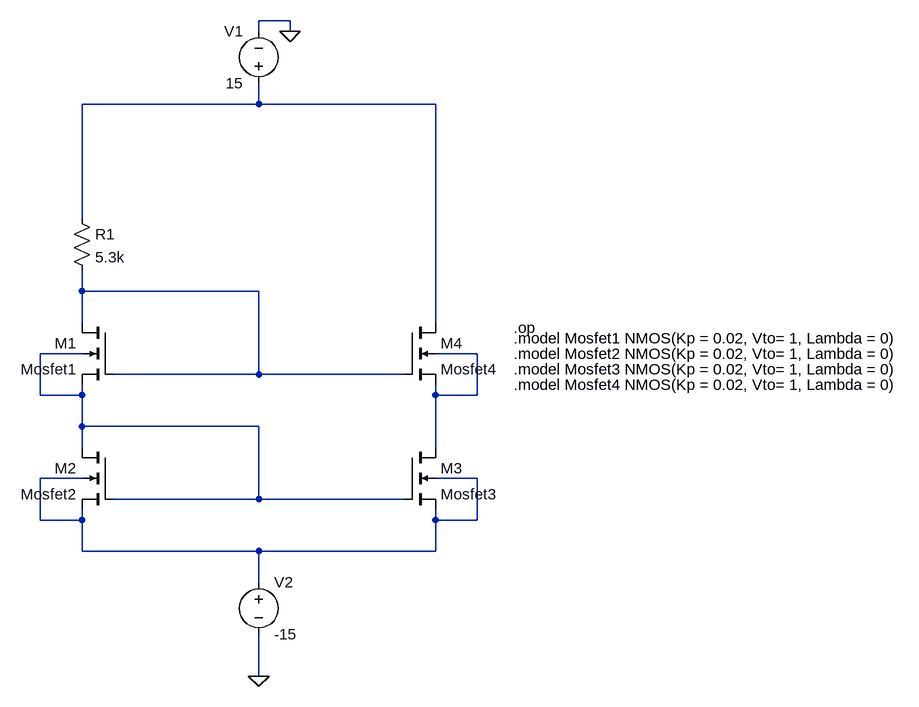
[diagram p0: schematic Simulation Bonus.asc]
Simulation Bonus.asc, the LTspice schematic file:
Version 4.1
SHEET 1 1464 868
WIRE 480 -192 432 -192
WIRE 432 -176 432 -192
WIRE 480 -176 480 -192
WIRE 432 -64 432 -96
WIRE 432 -64 160 -64
WIRE 704 -64 432 -64
WIRE 160 112 160 -64
WIRE 160 224 160 192
WIRE 432 224 160 224
WIRE 160 272 160 224
WIRE 704 272 704 -64
WIRE 160 320 96 320
WIRE 768 320 704 320
WIRE 432 352 432 224
WIRE 432 352 208 352
WIRE 656 352 432 352
WIRE 96 384 96 320
WIRE 160 384 160 368
WIRE 160 384 96 384
WIRE 704 384 704 368
WIRE 768 384 768 320
WIRE 768 384 704 384
WIRE 160 432 160 384
WIRE 432 432 160 432
WIRE 160 464 160 432
WIRE 704 464 704 384
WIRE 160 512 96 512
WIRE 768 512 704 512
WIRE 432 544 432 432
WIRE 432 544 208 544
WIRE 656 544 432 544
WIRE 96 576 96 512
WIRE 160 576 160 560
WIRE 160 576 96 576
WIRE 704 576 704 560
WIRE 768 576 768 512
WIRE 768 576 704 576
WIRE 160 624 160 576
WIRE 432 624 160 624
WIRE 704 624 704 576
WIRE 704 624 432 624
WIRE 432 672 432 624
WIRE 432 816 432 752
FLAG 432 816 0
FLAG 480 -176 0
SYMBOL res 144 96 R0
SYMATTR InstName R1
SYMATTR Value 5.3k
SYMBOL nmos4 208 272 M0
SYMATTR InstName M1
SYMATTR Value Mosfet1
SYMBOL nmos4 208 464 M0
SYMATTR InstName M2
SYMATTR Value Mosfet2
SYMBOL nmos4 656 464 R0
SYMATTR InstName M3
SYMATTR Value Mosfet3
SYMBOL nmos4 656 272 R0
SYMATTR InstName M4
SYMATTR Value Mosfet4
SYMBOL voltage 432 656 R0
WINDOW 123 0 0 Left 0
WINDOW 39 0 0 Left 0
SYMATTR InstName V2
SYMATTR Value -15
SYMBOL voltage 432 -80 R180
WINDOW 0 24 96 Left 2
WINDOW 3 24 16 Left 2
WINDOW 123 0 0 Left 0
WINDOW 39 0 0 Left 0
SYMATTR InstName V1
SYMATTR Value 15
TEXT 824 296 Left 2 !.model Mosfet1 NMOS(Kp = 0.02, Vto= 1, Lambda = 0)
TEXT 824 320 Left 2 !.model Mosfet2 NMOS(Kp = 0.02, Vto= 1, Lambda = 0)
TEXT 824 344 Left 2 !.model Mosfet3 NMOS(Kp = 0.02, Vto= 1, Lambda = 0)
TEXT 824 368 Left 2 !.model Mosfet4 NMOS(Kp = 0.02, Vto= 1, Lambda = 0)
TEXT 824 280 Left 2 !.op

The netlist it stands for:
* Simulation Bonus.asc
R1 N001 N002 5.3k
M1 N002 N002 N003 N003 Mosfet1
M2 N003 N003 N005 N005 Mosfet2
M3 N004 N003 N005 N005 Mosfet3
M4 N001 N002 N004 N004 Mosfet4
V2 N005 0 -15
V1 N001 0 15
.model NMOS NMOS
.model PMOS PMOS
.lib standard.mos
.model Mosfet1 NMOS(Kp = 0.02, Vto= 1, Lambda = 0)
.model Mosfet2 NMOS(Kp = 0.02, Vto= 1, Lambda = 0)
.model Mosfet3 NMOS(Kp = 0.02, Vto= 1, Lambda = 0)
.model Mosfet4 NMOS(Kp = 0.02, Vto= 1, Lambda = 0)
.op
.backanno
.end